# Altium schematic sheet STM32遥控.SchDoc
size A3
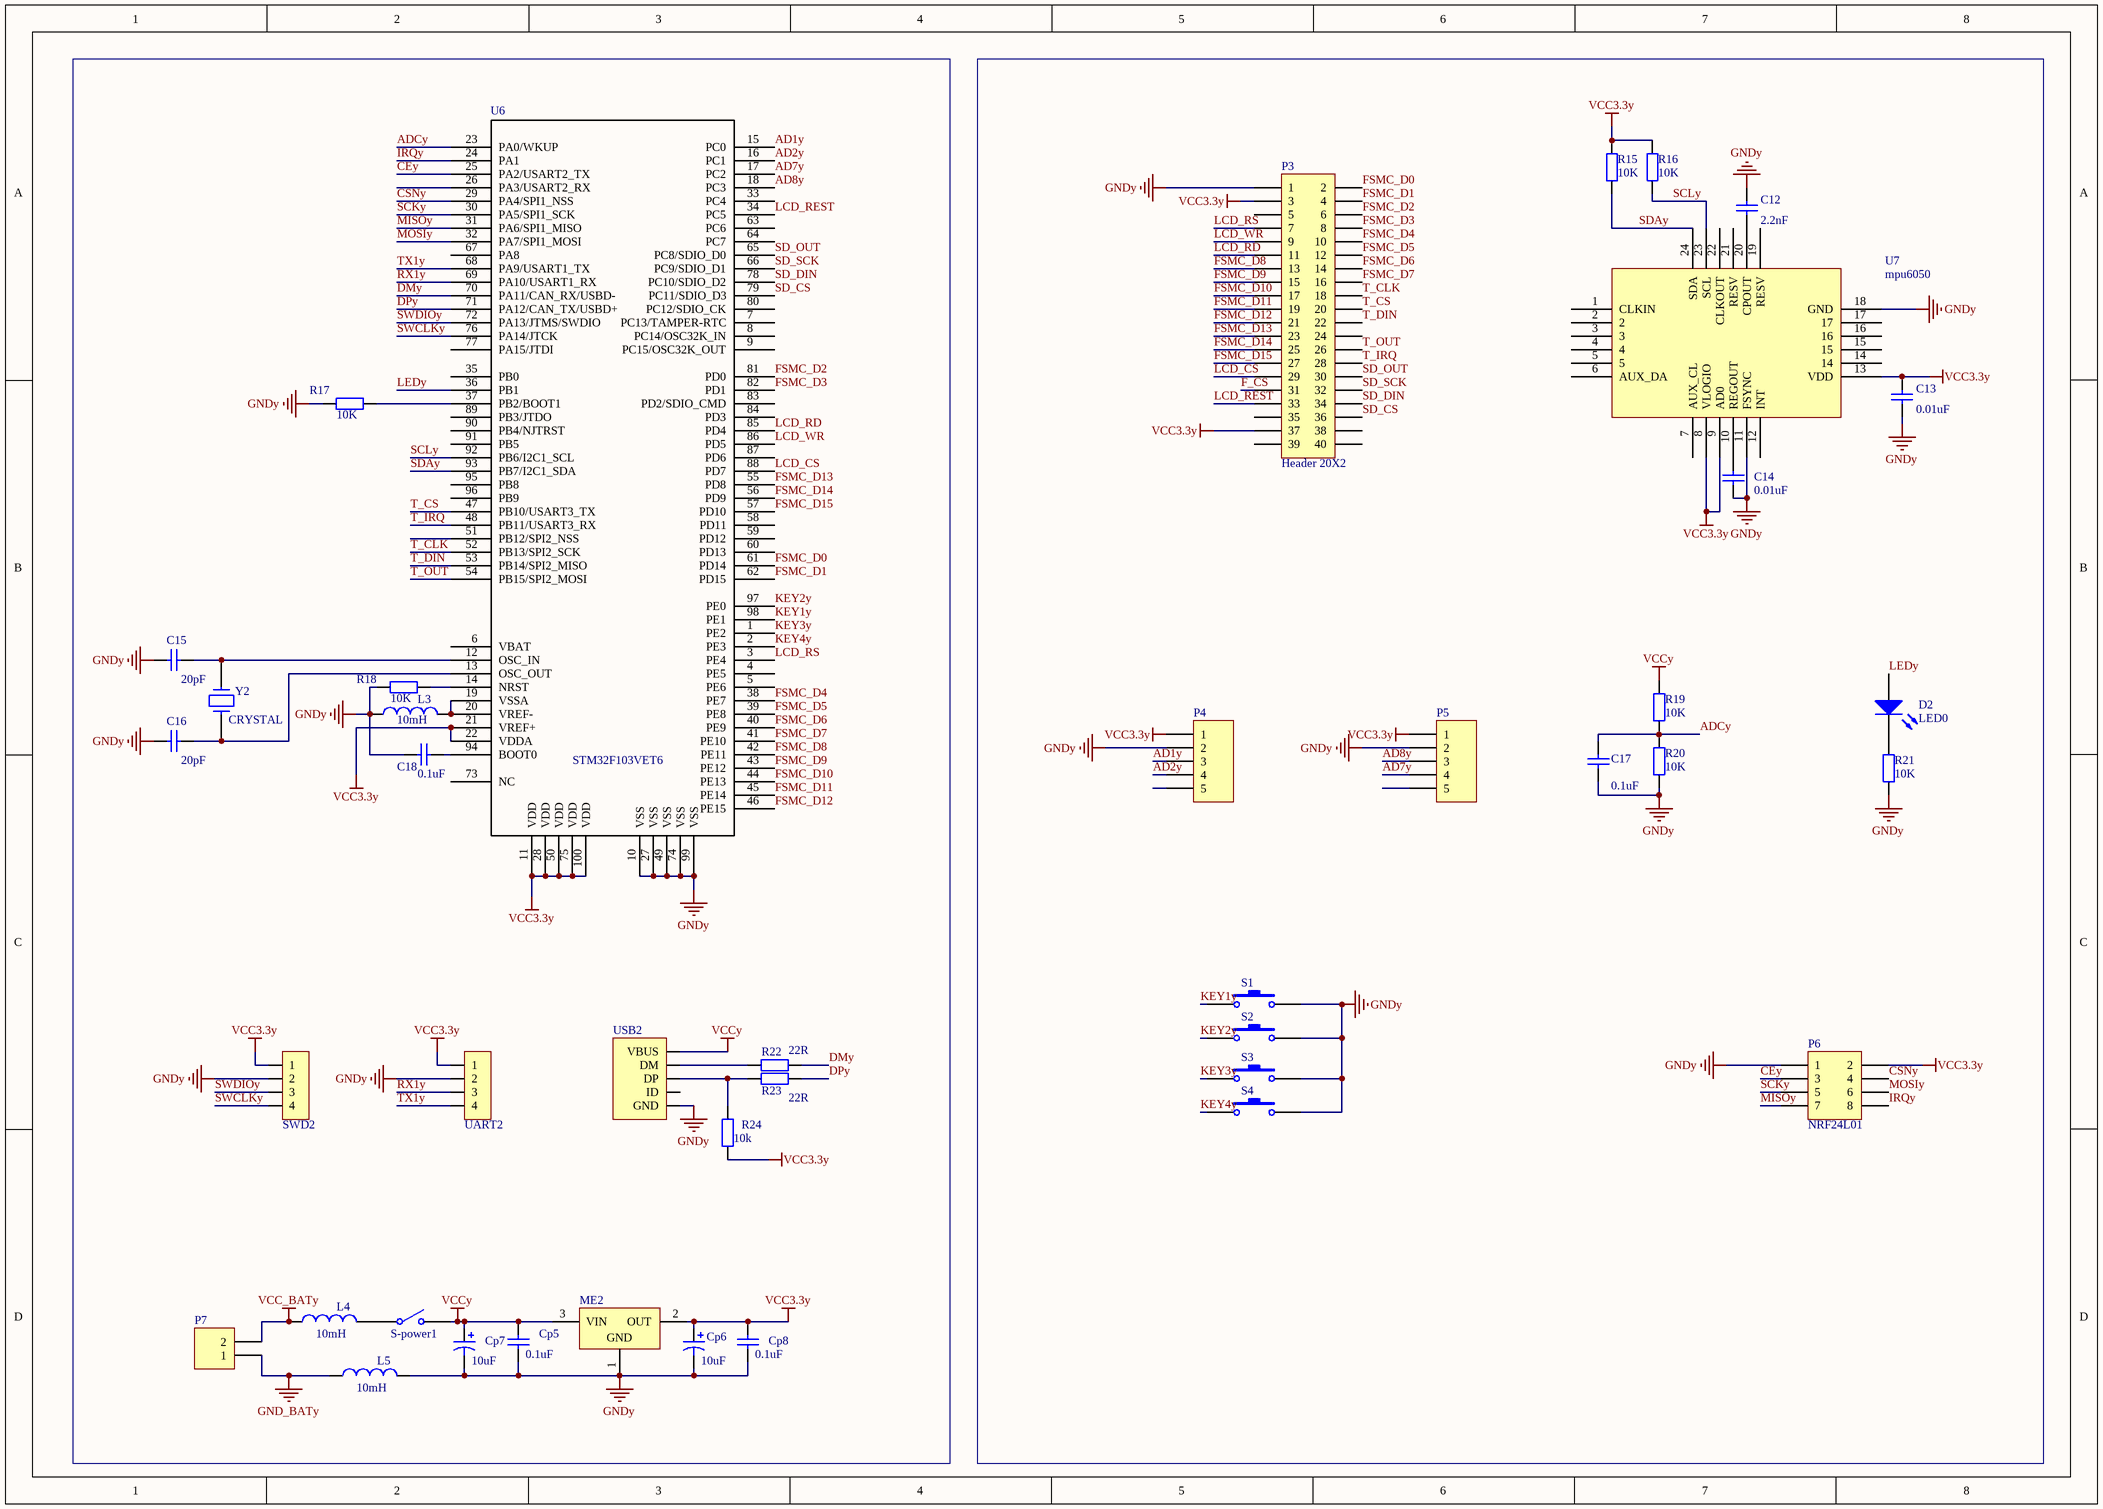
[diagram p0: STM32遥控.SchDoc]

## Parts
C12  value 2.2nF  [0805s]  (hidden comment: Cap)
C13  value 0.01uF  [0805s]  (hidden comment: Cap)
C14  value 0.01uF  [0805s]  (hidden comment: Cap)
C15  value 20pF  [0805s]  (hidden comment: Cap)
C16  value 20pF  [0805s]  (hidden comment: Cap)
C17  value 0.1uF  [0805s]  (hidden comment: Cap)
C18  value 0.1uF  [0805s]  (hidden comment: Cap)
Cp5  value 0.1uF  [0805s]  (hidden comment: Cap)
Cp6  value 10uF  [3216]  (hidden comment: Cap Pol1)
Cp7  value 10uF  [3216]  (hidden comment: Cap Pol1)
Cp8  value 0.1uF  [0805s]  (hidden comment: Cap)
D2  LED0  [0805s]
L3  value 10mH  [0805s]  (hidden comment: Inductor)
L4  value 10mH  [0805s]  (hidden comment: Inductor)
L5  value 10mH  [0805s]  (hidden comment: Inductor)
ME2  Volt Reg  [SOT-23]  (value not drawn)
P3  Header 20X2  [HDR2X20]
P4  Header 5  [yaogan]  (value not drawn)
P5  Header 5  [yaogan]  (value not drawn)
P6  NRF24L01  [HDR2X4]
P7  Header 2  [SIP2]  (value not drawn)
R15  value 10K  [0805s]  (hidden comment: Res2)
R16  value 10K  [0805s]  (hidden comment: Res2)
R17  value 10K  [0805s]  (hidden comment: Res2)
R18  value 10K  [0805s]  (hidden comment: Res2)
R19  value 10K  [0805s]  (hidden comment: Res2)
R20  value 10K  [0805s]  (hidden comment: Res2)
R21  value 10K  [0805s]  (hidden comment: Res2)
R22  value 22R  [0805s]  (hidden comment: Res_0603)
R23  value 22R  [0805s]  (hidden comment: Res_0603)
R24  value 10k  [0805s]  (hidden comment: Res_0603)
S1  SW-PB  [按键]  (value not drawn)
S2  SW-PB  [按键]  (value not drawn)
S3  SW-PB  [按键]  (value not drawn)
S4  SW-PB  [按键]  (value not drawn)
S-power1  SW-SPST  [SIP3]  (value not drawn)
SWD2  HDR1X4_180_2.54  [SIP4]  (value not drawn)
U6  STM32F103VET6  [LQFP100_N]
U7  mpu6050  [MPU6050]
UART2  HDR1X4_180_2.54  [SIP4]  (value not drawn)
USB2  USB_Micro  [MICRO-USB]  (value not drawn)
Y2  CRYSTAL  [SIP2]

## Nets
GND_BATy: L5.1 P7.1
GNDy: C12.2 C13.1 C14.1 C15.1 C16.1 C17.1 C18.1 Cp5.1 Cp6.2 Cp7.2 Cp8.1 L3.1 L5.2 ME2.1(GND) P3.1 P4.2 P5.2 P6.1 R17.2 R18.2 R20.1 R21.1 S1.2 S2.2 S3.2 S4.2 SWD2.2 U6.10(VSS) U6.27(VSS) U6.49(VSS) U6.74(VSS) U6.99(VSS) U7.11(FSYNC) U7.18(GND) UART2.2 USB2.5(GND)
VCC3.3y: C13.2 Cp6.1 Cp8.2 ME2.2(OUT) P3.3 P3.37 P4.1 P5.1 P6.2 R15.2 R16.2 R24.2 SWD2.1 U6.11(VDD) U6.21(VREF+) U6.22(VDDA) U6.28(VDD) U6.50(VDD) U6.75(VDD) U6.100(VDD) U7.8(VLOGIO) U7.9(AD0) U7.13(VDD) UART2.1
VCC_BATy: L4.1 P7.2
VCCy: Cp5.2 Cp7.1 ME2.3(VIN) R19.2 S-power1.2(NO) USB2.1(VBUS)
AD1y: P4.3 U6.15(PC0)
AD2y: P4.4 U6.16(PC1)
AD7y: P5.4 U6.17(PC2)
AD8y: P5.3 U6.18(PC3)
ADCy: C17.2 R19.1 R20.2 U6.23(PA0/WKUP)
CEy: P6.3 U6.25(PA2/USART2_TX)
CSNy: P6.4 U6.29(PA4/SPI1_NSS)
DMy: R22.2 U6.70(PA11/CAN_RX/USBD-)
DPy: R23.2 U6.71(PA12/CAN_TX/USBD+)
F_CS: P3.31
FSMC_D0: P3.2 U6.61(PD14)
FSMC_D1: P3.4 U6.62(PD15)
FSMC_D2: P3.6 U6.81(PD0)
FSMC_D3: P3.8 U6.82(PD1)
FSMC_D4: P3.10 U6.38(PE7)
FSMC_D5: P3.12 U6.39(PE8)
FSMC_D6: P3.14 U6.40(PE9)
FSMC_D7: P3.16 U6.41(PE10)
FSMC_D8: P3.13 U6.42(PE11)
FSMC_D9: P3.15 U6.43(PE12)
FSMC_D10: P3.17 U6.44(PE13)
FSMC_D11: P3.19 U6.45(PE14)
FSMC_D12: P3.21 U6.46(PE15)
FSMC_D13: P3.23 U6.55(PD8)
FSMC_D14: P3.25 U6.56(PD9)
FSMC_D15: P3.27 U6.57(PD10)
IRQy: P6.8 U6.24(PA1)
KEY1y: S1.1 U6.98(PE1)
KEY2y: S2.1 U6.97(PE0)
KEY3y: S3.1 U6.1(PE2)
KEY4y: S4.1 U6.2(PE3)
LCD_CS: P3.29 U6.88(PD7)
LCD_RD: P3.11 U6.85(PD4)
LCD_REST: P3.33 U6.34(PC5)
LCD_RS: P3.7 U6.3(PE4)
LCD_WR: P3.9 U6.86(PD5)
LEDy: D2.1(A) U6.36(PB1)
MISOy: P6.7 U6.31(PA6/SPI1_MISO)
MOSIy: P6.6 U6.32(PA7/SPI1_MOSI)
RX1y: U6.69(PA10/USART1_RX) UART2.3
SCKy: P6.5 U6.30(PA5/SPI1_SCK)
SCLy: R16.1 U6.92(PB6/I2C1_SCL) U7.23(SCL)
SD_CS: P3.36 U6.79(PC11/SDIO_D3)
SD_DIN: P3.34 U6.78(PC10/SDIO_D2)
SD_OUT: P3.30 U6.65(PC8/SDIO_D0)
SD_SCK: P3.32 U6.66(PC9/SDIO_D1)
SDAy: R15.1 U6.93(PB7/I2C1_SDA) U7.24(SDA)
SWCLKy: SWD2.4 U6.76(PA14/JTCK)
SWDIOy: SWD2.3 U6.72(PA13/JTMS/SWDIO)
T_CLK: P3.18 U6.52(PB13/SPI2_SCK)
T_CS: P3.20 U6.47(PB10/USART3_TX)
T_DIN: P3.22 U6.53(PB14/SPI2_MISO)
T_IRQ: P3.28 U6.48(PB11/USART3_RX)
T_OUT: P3.26 U6.54(PB15/SPI2_MOSI)
TX1y: U6.68(PA9/USART1_TX) UART2.4
NetC12_1: C12.1 U7.20(CPOUT)
NetC14_2: C14.2 U7.10(REGOUT)
NetC15_2: C15.2 U6.12(OSC_IN) Y2.2
NetC16_2: C16.2 U6.13(OSC_OUT) Y2.1
NetC18_2: C18.2 U6.94(BOOT0)
NetD2_2: D2.2(K) R21.2
NetL3_2: L3.2 U6.19(VSSA) U6.20(VREF-)
NetL4_2: L4.2 S-power1.1(COMMON)
NetR17_1: R17.1 U6.37(PB2/BOOT1)
NetR18_1: R18.1 U6.14(NRST)
NetR22_1: R22.1 USB2.2(DM)
NetR23_1: R23.1 R24.1 USB2.3(DP)

Not connected (* = marked no-connect by the designer): P3 5 24 35 38 39 40; P4 5; P5 5; U6 4(PE5) 5(PE6) 6(VBAT) 7(PC13/TAMPER-RTC) 8(PC14/OSC32K_IN) 9(PC15/OSC32K_OUT) 26(PA3/USART2_RX) 33(PC4) 35(PB0) 51(PB12/SPI2_NSS) 58(PD11) 59(PD12) 60(PD13) 63(PC6) 64(PC7) 67(PA8) 73(NC) 77(PA15/JTDI) 80(PC12/SDIO_CK) 83(PD2/SDIO_CMD) 84(PD3) 87(PD6) 89(PB3/JTDO) 90(PB4/NJTRST) 91(PB5) 95(PB8) 96(PB9); U7 1(CLKIN) 2 3 4 5 6(AUX_DA) 7(AUX_CL) 12(INT) 14 15 16 17 19(RESV) 21(RESV) 22(CLKOUT); USB2 4(ID)

## Library data of the parts
C12-C18 Cp5 Cp8 = Cap: Capacitor; Published: 8-Jun-2000; LatestRevisionDate: 17-Jul-2002; LatestRevisionNote: Re-released for DXP Platform.; PackageReference: RAD-0.3; Publisher: Altium Limited
Cp6 Cp7 = Cap Pol1: Polarized Capacitor (Radial); Published: 8-Jun-2000; LatestRevisionDate: 17-Jul-2002; LatestRevisionNote: Re-released for DXP Platform.; PackageReference: RB7.6-15; Publisher: Altium Limited
D2 = LED0: Typical INFRARED GaAs LED; Published: 8-Jun-2000; LatestRevisionDate: 08-Jul-2005; LatestRevisionNote: Mech Layer 1 removed.; PackageReference: LED-0; Publisher: Altium Limited
L3-L5 = Inductor: Code_IEC: 1005; Published: 8-Jun-2000; LatestRevisionDate: 29-May-2009; LatestRevisionNote: IPC-7351 Footprint Added.; PackageReference: 0402-A; Publisher: Altium Limited; PackageDescription: Chip Inductor; Code_JEITA: 0402
ME2 = Volt Reg: Voltage Regulator; Published: 24-Mar-1999; LatestRevisionDate: 29-May-2009; LatestRevisionNote: IPC-7351 Footprint Added.; PackageReference: D2PAK; Publisher: Altium Limited; PackageDescription: 3-Pin Transistor Outline Package 2.54 mm Pitch, 15.1 mm Lead Span
P3 = Header 20X2: Header, 20-Pin, Dual row; LatestRevisionDate: 17-Jul-2002; LatestRevisionNote: Re-released for DXP Platform.; Publisher: Altium Limited
P4 P5 = Header 5: Header, 5-Pin; LatestRevisionDate: 17-Jul-2002; LatestRevisionNote: Re-released for DXP Platform.; Publisher: Altium Limited
P6 = MHDR2X4: Header, 4-Pin, Dual row; LatestRevisionDate: 17-Jul-2002; LatestRevisionNote: Re-released for DXP Platform.; Publisher: Altium Limited
P7 = Header 2: Header, 2-Pin; LatestRevisionDate: 17-Jul-2002; LatestRevisionNote: Re-released for DXP Platform.; Publisher: Altium Limited
R15-R21 = Res2: Resistor; Published: 8-Jun-2000; LatestRevisionDate: 17-Jul-2002; LatestRevisionNote: Re-released for DXP Platform.; PackageReference: AXIAL-0.4; Publisher: Altium Limited
R22-R24 = Res_0603: Resistor
S1-S4 = SW-PB: Switch; Published: 24-Mar-1999; LatestRevisionDate: 17-Jul-2002; LatestRevisionNote: Re-released for DXP Platform.; PackageReference: SPST-2; Publisher: Altium Limited
S-power1 = SW-SPST: Single-Pole, Single-Throw Switch; Published: 24-Mar-1999; LatestRevisionDate: 17-Jul-2002; LatestRevisionNote: Re-released for DXP Platform.; PackageReference: SPST-2; Publisher: Altium Limited
SWD2 UART2 = HDR1X4_180_2.54: Header
USB2 = USB_Micro: USB